# EAGLE design ms_kb_reader (EAGLE 7.2.0)
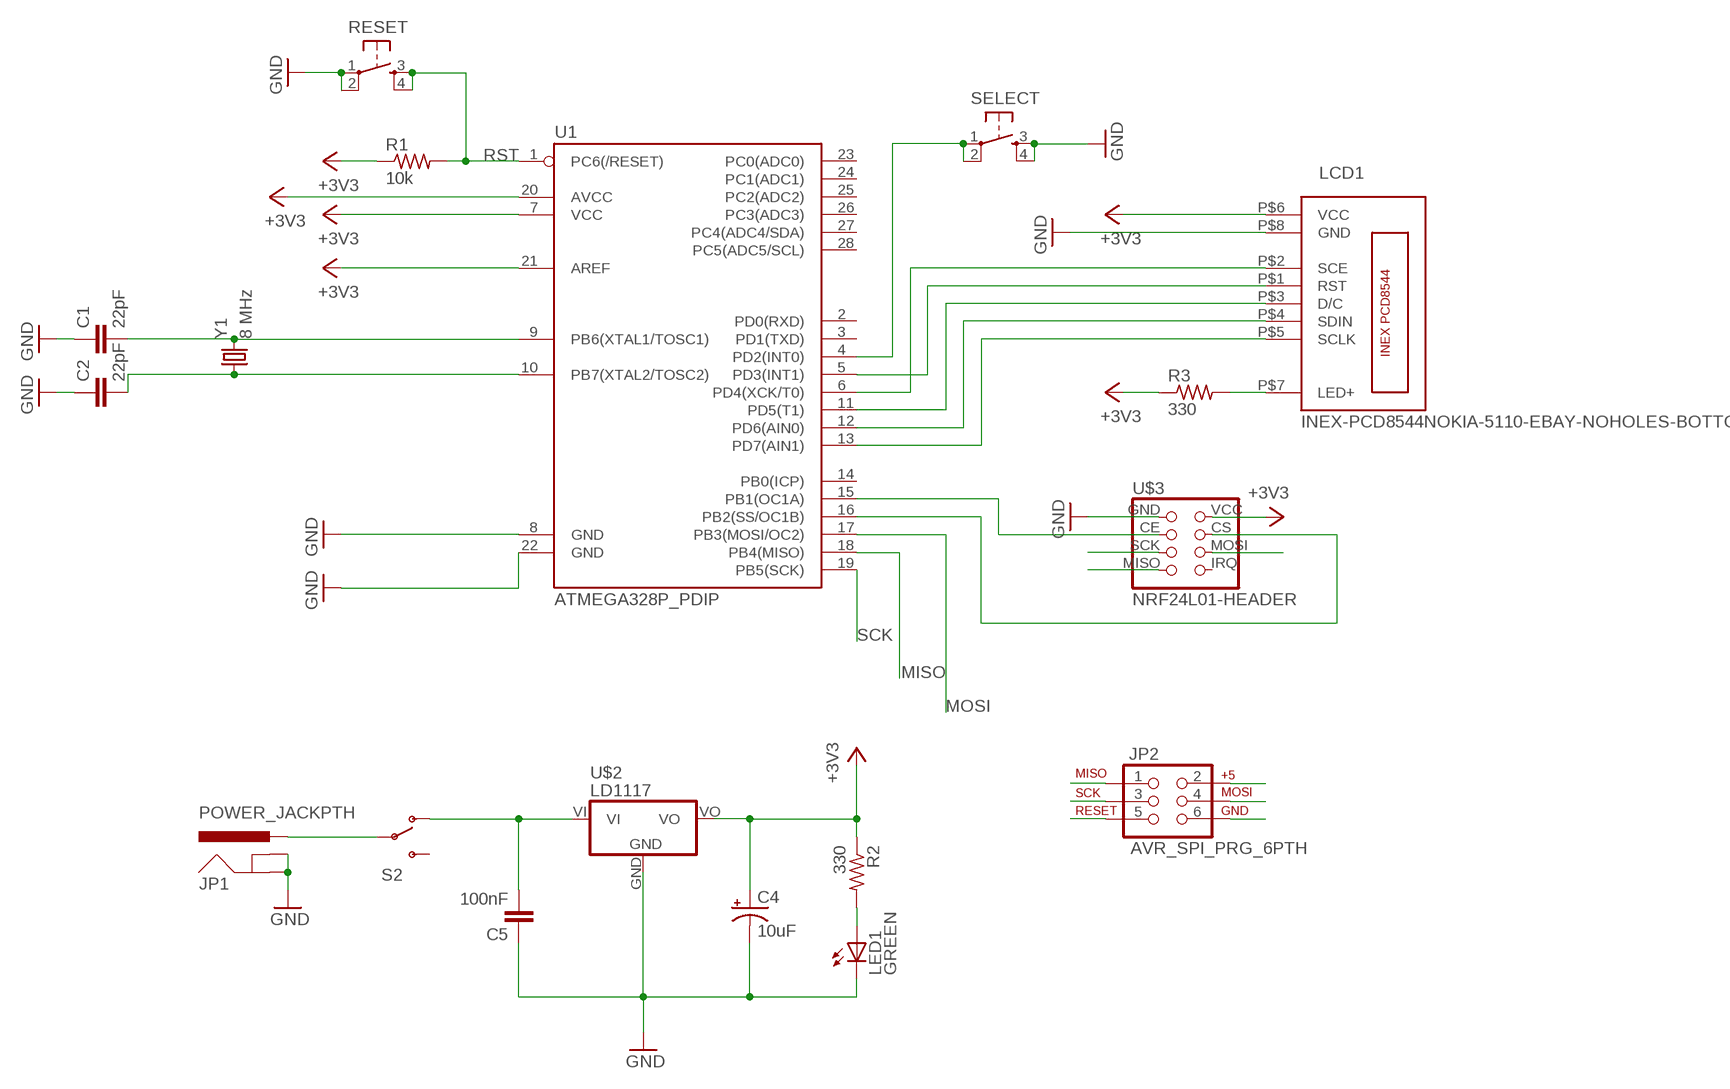
[diagram p0: schematic, sheet 1]

## Parts
C1  22pF  CAPPTH  [CAP-PTH-SMALL]
C2  22pF  CAPPTH  [CAP-PTH-SMALL]
C4  10uF  CPOL-USE2.5-5  [E2,5-5]
C5  100nF  CAPPTH  [CAP-PTH-SMALL]
JP1  POWER_JACKPTH  [POWER_JACK_PTH]
JP2  AVR_SPI_PRG_6PTH  [2X3]
LCD1  INEX-PCD8544NOKIA-5110-EBAY-NOHOLES-BOTTOM  [NOKIA-5110-EBAY-NOHOLES]
LED1  GREEN  LED5MM  [LED5MM]
R1  10k  R-US_0207/10  [0207/10]
R2  330  R-US_0207/10  [0207/10]
R3  330  R-US_0207/10  [0207/10]
RESET  TACTILE-SWITCH-PTH  [TAC-SWITCH-PTH]
S2  SWITCH-SPDTPTH_LOCK  [SWITCH-SPDT_LOCK.007S]
SELECT  TACTILE-SWITCH-PTH  [TAC-SWITCH-PTH]
U1  ATMEGA328P_PDIP  [DIL28-3]
U$2  LD1117  [LD1117]
U$3  NRF24L01-HEADER  [NRF24L01-HEADER]
Y1  8 MHz  CRYSTALHC49US  [HC49US]

## Nets
+3V3: C4.+ JP2.2 LCD1.P$6(VCC) R1.1 R2.1 R3.1 U1.7(VCC) U1.20(AVCC) U1.21(AREF) U$2.VO U$3.VCC
GND: C1.1 C2.1 C4.- C5.1 JP1.GND JP1.GNDBREAK JP2.6 LCD1.P$8(GND) LED1.K(C) RESET.1 RESET.2 SELECT.3 SELECT.4 U1.8(GND) U1.22(GND) U$2.GND U$3.GND
MISO: JP2.1 U1.18(PB4(MISO)) U$3.MISO
MOSI: JP2.4 U1.17(PB3(MOSI/OC2)) U$3.MOSI
N$1: LCD1.P$1(RST) U1.5(PD3(INT1))
N$2: LCD1.P$2(SCE) U1.6(PD4(XCK/T0))
N$3: LCD1.P$3(D/C) U1.11(PD5(T1))
N$4: LED1.A R2.2
N$5: C5.2 S2.1(O) U$2.VI
N$6: JP1.PWR S2.2(P)
N$7: LCD1.P$4(SDIN) U1.12(PD6(AIN0))
N$8: SELECT.1 SELECT.2 U1.4(PD2(INT0))
N$9: LCD1.P$5(SCLK) U1.13(PD7(AIN1))
N$10: U1.16(PB2(SS/OC1B)) U$3.CS
N$11: C2.2 U1.10(PB7(XTAL2/TOSC2)) Y1.1
N$12: C1.2 U1.9(PB6(XTAL1/TOSC1)) Y1.2
N$13: U1.15(PB1(OC1A)) U$3.CE
N$15: LCD1.P$7(LED+) R3.2
RST: JP2.5 R1.2 RESET.3 RESET.4 U1.1(PC6(/RESET))
SCK: JP2.3 U1.19(PB5(SCK)) U$3.SCK
Unconnected: S2.3(S) U1.2(PD0(RXD)) U1.3(PD1(TXD)) U1.14(PB0(ICP)) U1.23(PC0(ADC0)) U1.24(PC1(ADC1)) U1.25(PC2(ADC2)) U1.26(PC3(ADC3)) U1.27(PC4(ADC4/SDA)) U1.28(PC5(ADC5/SCL)) U$3.IRQ

## Library data of the parts
C1 C2 C5 = SparkFun-Capacitors:CAP: Capacitor Standard 0603 ceramic capacitor, and 0.1" leaded capacitor.
C4 = rcl:CPOL-US: POLARIZED CAPACITOR, American symbol
JP1 = SparkFun-Connectors:POWER_JACK: Power Jack This is the standard 5.5mm barrel jack for power. The PTH is the most common, proven, reliable, footprint. The Slot footprint only works if the mill layer is transmitted to the PCB fab house so be warned. Mating wall wart : TOL-00298 (and others); PROD_ID: CONN-08197
JP2 = SparkFun-Connectors:AVR_SPI_PRG_6: AVR ISP 6 Pin This is the reduced ISP connector for AVR programming. Common on Arduino. This footprint will take up less PCB space and can be used with a 10-pin to 6-pin adapter such as SKU: BOB-08508 **Special note about "TEST_POINT" package. The stop mask is on the top side, so if you want your programming test points to be on the bottom of your board, make sure to place this package on the bottom side of the board. This also ensure that the orientation to program from the bottom side will be correct.
LCD1 = synfinatic:INEX-PCD8544: INEX PCD8544 LCD Basically a Nokia 5110 LCD with 8 pins. Available at Robotshop.com Note that this PCB has two sets of contacts, top has pins, the bottom has through-hole pads. If you want to use the pads on the bottom, use the alternate package
LED1 = led:LED: LED OSRAM: - CHIPLED LG R971, LG N971, LY N971, LG Q971, LY Q971, LO R971, LY R971 LH N974, LH R974 LS Q976, LO Q976, LY Q976 LO Q996 - Hyper CHIPLED LW Q18S LB Q993, LB Q99A, LB R99A - SideLED LS A670, LO A670, LY A670, LG A670, LP A670 LB A673, LV A673, LT A673, LW A673 LH A674 LY A675 LS A676, LA A676, LO A676, LY A676, LW A676 LS A679, LY A679, LG A679 - Hyper Micro SIDELED® LS Y876, LA Y876, LO Y876, LY Y876 LT Y87S - SmartLED LW L88C, LW L88S LB L89C, LB L89S, LG L890 LS L89K, LO L89K, LY L89K LS L896, LA L896, LO L896, LY L896 - TOPLED LS T670, LO T670, LY T670, LG T670, LP T670 LSG T670, LSP T670, LSY T670, LOP T670, LYG T670 LG T671, LOG T671, LSG T671 LB T673, LV T673, LT T673, LW T673 LH T674 LS T676, LA T676, LO T676, LY T676, LB T676, LH T676, LSB T676, LW T676 LB T67C, LV T67C, LT T67C, LS T67K, LO T67K, LY T67K, LW E67C LS E67B, LA E67B, LO E67B, LY E67B, LB E67C, LV E67C, LT E67C LW T67C LS T679, LY T679, LG T679 LS T770, LO T770, LY T770, LG T770, LP T770 LB T773, LV T773, LT T773, LW T773 LH T774 LS E675, LA E675, LY E675, LS T675 LS T776, LA T776, LO T776, LY T776, LB T776 LHGB T686 LT T68C, LB T68C - Hyper Mini TOPLED® LB M676 - Mini TOPLED Santana® LG M470 LS M47K, LO M47K, LY M47K Source: http://www.osram.convergy.de LUXEON: - LUMILED® LXK2-PW12-R00, LXK2-PW12-S00, LXK2-PW14-U00, LXK2-PW14-V00 LXK2-PM12-R00, LXK2-PM12-S00, LXK2-PM14-U00 LXK2-PE12-Q00, LXK2-PE12-R00, LXK2-PE12-S00, LXK2-PE14-T00, LXK2-PE14-U00 LXK2-PB12-K00, LXK2-PB12-L00, LXK2-PB12-M00, LXK2-PB14-N00, LXK2-PB14-P00, LXK2-PB14-Q00 LXK2-PR12-L00, LXK2-PR12-M00, LXK2-PR14-Q00, LXK2-PR14-R00 LXK2-PD12-Q00, LXK2-PD12-R00, LXK2-PD12-S00 LXK2-PH12-R00, LXK2-PH12-S00 LXK2-PL12-P00, LXK2-PL12-Q00, LXK2-PL12-R00 Source: www.luxeon.com KINGBRIGHT: KA-3528ASYC Source: www.kingbright.com
R1-R3 = rcl:R-US_: RESISTOR, American symbol
RESET SELECT = GeekAmmo:TACTILE-SWITCH: Tactile Switch 4 Pins, SPST NO
S2 = SparkFun-Electromechanical:SWITCH-SPDT: SPDT Switch Simple slide switch, Spark Fun Electronics SKU : COM-00102 DPDT SMT slide switch, AYZ0202, SWCH-08179
U1 = SparkFun-DigitalIC:ATMEGA328P_PDIP: uC used in the Arduino 32kb flash, 1k EEPROM, 2k SRAM This is the through-hole version of this chip.
U$2 = LD1117:LD1117
U$3 = nRF24L01-header:NRF24L01-HEADER
Y1 = SparkFun-FreqCtrl:CRYSTAL: Various standard crystals. Proven footprints.

## Board
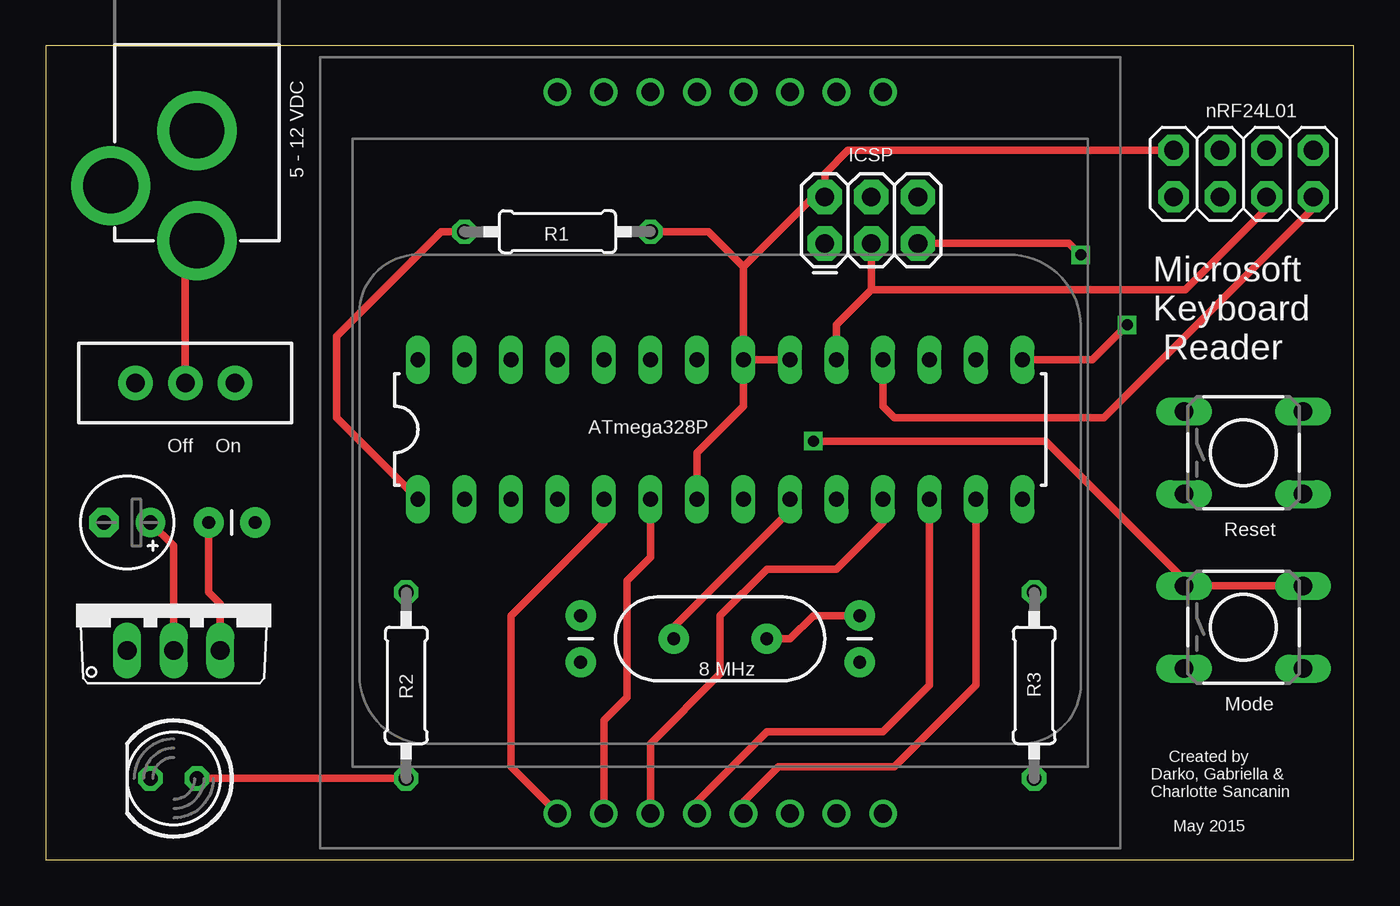
[diagram p1: board, top side]
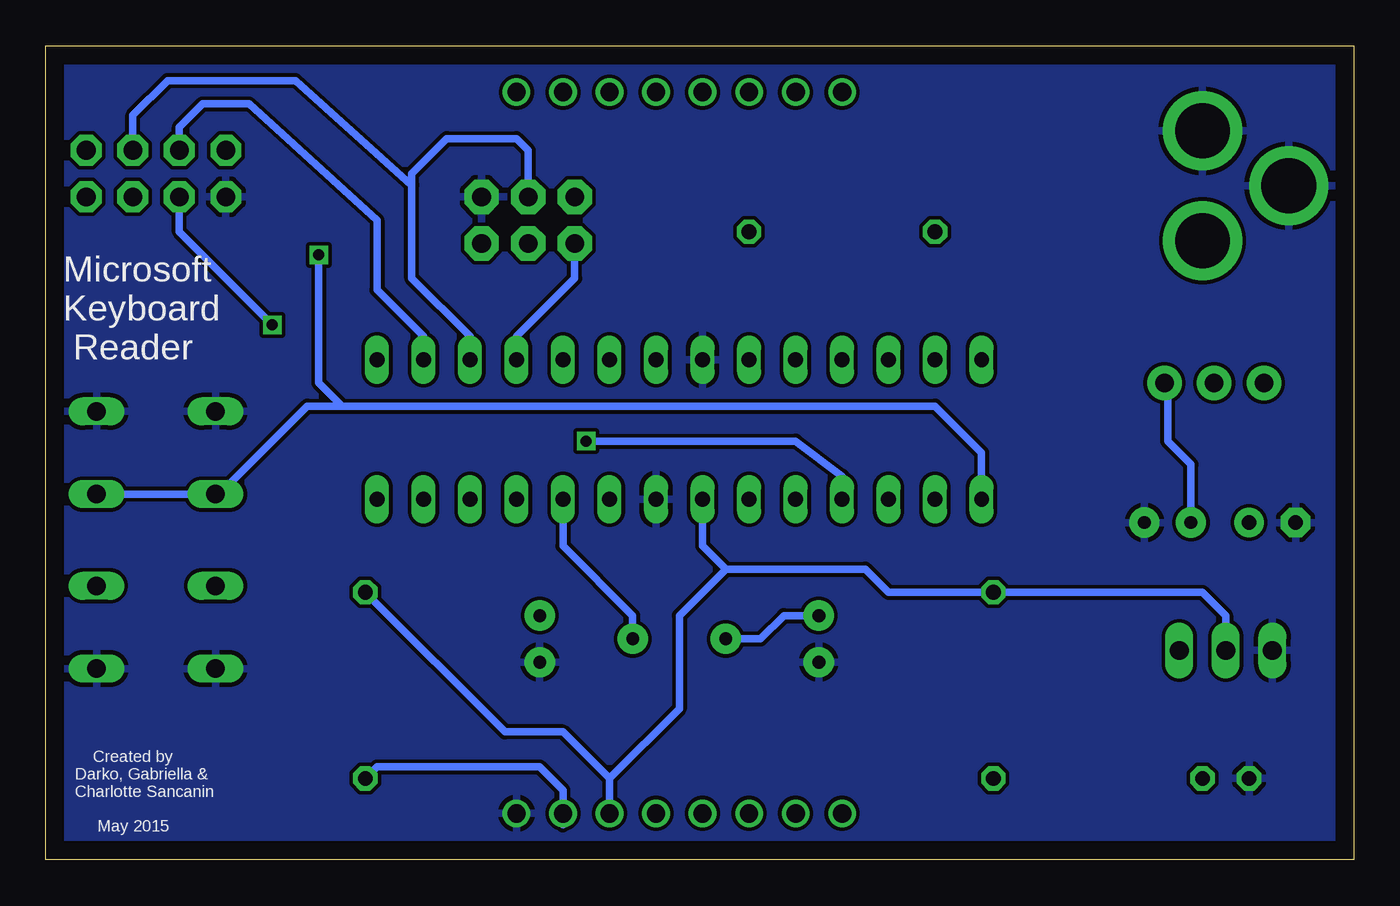
[diagram p2: board, bottom side, seen from below]

Size 71.42 x 44.44 mm. Coordinates in mm from the lower left corner, seen from the top.
Outline: 0,0 71.42,0 71.42,44.44 0,44.44 0,0
Copper layers (1*16): Top 0.035mm / dielectric 1.5mm / Bottom 0.035mm
Design rules "default": minimum track width 10mil, minimum drill 24mil, track to track 8mil, track to pad 8mil, pad to pad 8mil, via to via 8mil, smd to smd 8mil, copper to edge 40mil, drill to drill 8mil, minimum pad ring 10mil, minimum via ring 8mil, stop-mask expansion 4mil, vias tented up to drill 0mil, thermal gap 10mil

### Footprints (pad centres in the part's own frame; a part is rotated, then mirrored left to right if it is on the bottom)
CAP-PTH-SMALL = drill 0.7 pad 1.651: 1 0,0; 2 2.54,0
E2,5-5 = drill 0.813 pad 1.6: + -1.27,0 | drill 0.813 pad 1.6 octagon: - 1.27,0
POWER_JACK_PTH = drill 2.997 pad 4.318: GND 0,7.7; GNDBREAK 4.7,10.7; PWR 0,13.7
2X3 = drill 1.016 pad 1.88 octagon: 1 0,0; 2 0,2.54; 3 2.54,0; 4 2.54,2.54; 5 5.08,0; 6 5.08,2.54
NOKIA-5110-EBAY-NOHOLES = drill 1: P$1 -8.89,-15.875; P$2 -6.35,-15.875; P$3 -3.81,-15.875; P$4 -1.27,-15.875; P$5 1.27,-15.875; P$6 3.81,-15.875; P$7 6.35,-15.875; P$8 8.89,-15.875; P$9 -8.89,23.495; P$10 -6.35,23.495; P$11 -3.81,23.495; P$12 -1.27,23.495; P$13 1.27,23.495; P$14 3.81,23.495; P$15 6.35,23.495; P$16 8.89,23.495
LED5MM = drill 0.813 octagon: A -1.27,0; K 1.27,0
0207/10 = drill 0.813 octagon: 1 -5.08,0; 2 5.08,0
TAC-SWITCH-PTH = drill 1.016 pad 1.524 long: 1 -3.251,2.261; 2 3.251,2.261; 3 -3.251,-2.261; 4 3.251,-2.261
SWITCH-SPDT_LOCK.007S = drill 1.016 pad 1.88: 1 0,2.718; 2 0,0; 3 0,-2.718
DIL28-3 = drill 0.813 long: 1 -16.51,-3.81; 2 -13.97,-3.81; 3 -11.43,-3.81; 4 -8.89,-3.81; 5 -6.35,-3.81; 6 -3.81,-3.81; 7 -1.27,-3.81; 8 1.27,-3.81; 9 3.81,-3.81; 10 6.35,-3.81; 11 8.89,-3.81; 12 11.43,-3.81; 13 13.97,-3.81; 14 16.51,-3.81; 15 16.51,3.81; 16 13.97,3.81; 17 11.43,3.81; 18 8.89,3.81; 19 6.35,3.81; 20 3.81,3.81; 21 1.27,3.81; 22 -1.27,3.81; 23 -3.81,3.81; 24 -6.35,3.81; 25 -8.89,3.81; 26 -11.43,3.81; 27 -13.97,3.81; 28 -16.51,3.81
LD1117 = drill 1.016 long: GND -2.54,0; VI 2.54,0; VO 0,0
NRF24L01-HEADER = drill 1.016 pad 1.676 octagon: CE -1.27,-1.27; CS -1.27,1.27; GND -3.81,-1.27; IRQ 3.81,1.27; MISO 3.81,-1.27; MOSI 1.27,1.27; SCK 1.27,-1.27; VCC -3.81,1.27
HC49US = drill 0.7 pad 1.651: 1 -2.54,0; 2 2.54,0

### Placement (x,y rotation side)
C1  29.21,10.8 90 top
C2  44.45,10.8 90 top
C4  4.45,18.41 180 top
C5  11.43,18.41 180 top
JP1  8.26,47.5 180 top
JP2  42.55,33.66 0 top
LCD1  36.83,18.41 0 top
LED1  6.99,4.45 180 top
R1  27.94,34.29 180 top
R2  19.68,9.53 270 top
R3  53.98,9.53 270 top
RESET  65.41,22.23 0 top
S2  7.62,26.04 270 top
SELECT  65.41,12.7 0 top
U1  36.83,23.5 0 top
U$2  6.99,11.43 0 top
U$3  65.41,37.47 0 top
Y1  36.83,12.07 180 top

### Tracks (layer width: path | path; a pad name or v marks a point on that pad's centre or on a via)
+3V3
  Top 0.406: U$2.VO 6.99,17.14 C4.+ | U1.21 38.1,24.77 35.56,22.23 U1.7 | U1.20 U1.21 | 38.1,32.39 41.91,36.19 JP2.2 42.55,37.47 43.81,38.73 U$3.VCC | U1.21 38.1,32.39 | R1.1 36.2,34.29 38.1,32.39
  Bottom 0.406: U$2.VO 6.99,13.34 8.26,14.61 R2.1 25.4,14.61 26.67,15.88 34.29,15.88 | 34.29,15.88 36.83,13.34 36.83,8.26 40.64,4.45 | U1.7 35.56,17.14 34.29,15.88 | 40.64,4.45 LCD1.P$6 | 40.64,4.45 43.18,6.98 46.35,6.98 R3.1
GND
  pour Bottom: 0,45.08 0,-1.9 72.39,-1.9 72.39,45.08
MISO
  Top 0.406: U1.18 45.72,24.77 46.35,24.13 57.78,24.13 69.22,35.56 U$3.MISO
  Bottom 0.406: U1.18 45.72,28.57 42.55,31.75 JP2.1
MOSI
  Bottom 0.406: U1.17 48.26,28.57 51.44,31.75 51.44,36.83 | 51.44,36.83 57.78,42.55 64.77,42.55 66.67,40.64 U$3.MOSI | 51.44,36.83 51.44,37.47 49.53,39.37 45.72,39.37 45.09,38.73 JP2.4
N$1
  Top 0.406: U1.5 30.48,18.41 25.4,13.34 25.4,5.08 LCD1.P$1
N$2
  Top 0.406: LCD1.P$2 30.48,7.62 31.75,8.89 31.75,15.24 33.02,16.51 U1.6
N$3
  Top 0.406: LCD1.P$3 33.02,6.35 36.83,10.16 36.83,13.34 39.37,15.88 43.18,15.88 45.72,18.41 U1.11
N$4
  Top 0.406: LED1.A R2.2
N$5
  Top 0.406: C5.2 8.89,14.61 9.53,13.97 U$2.VI
  Bottom 0.406: C5.2 8.89,21.59 10.16,22.86 10.16,25.86 S2.1
N$6
  Top 0.406: S2.2 7.62,33.16 JP1.PWR
N$7
  Top 0.406: LCD1.P$4 35.56,3.18 39.37,6.98 45.72,6.98 48.26,9.53 U1.12
N$8  (via drill 0.6)
  Top 0.406: v41.91,22.86 54.61,22.86 62.15,15.32 SELECT.1 SELECT.2
  Bottom 0.406: v41.91,22.86 30.48,22.86 27.94,20.96 U1.4
N$9
  Top 0.406: LCD1.P$5 38.1,3.18 40.01,5.08 46.35,5.08 50.8,9.53 U1.13
N$10
  Bottom 0.406: U1.16 50.8,28.57 53.34,31.11 53.34,34.92 60.33,41.28 62.87,41.28 64.14,40 U$3.CS
N$11
  Top 0.406: Y1.1 40.64,12.07 41.91,13.34 C2.2
  Bottom 0.406: U1.10 43.18,17.14 39.37,13.34 Y1.1
N$12
  Top 0.406: Y1.2 34.29,12.7 40.64,19.05 U1.9
  Bottom 0.406: Y1.2 32.38,12.07 31.11,13.34 C1.2
N$13  (via drill 0.6)
  Top 0.406: v59.05,29.21 57.15,27.31 U1.15
  Bottom 0.406: U$3.CE 64.14,34.29 v59.05,29.21
N$15
  Bottom 0.406: 43.18,1.91 LCD1.P$7 43.18,3.81 44.13,4.76 44.45,5.08 53.34,5.08 R3.2
RST  (via drill 0.6)
  Top 0.406: R1.2 21.59,34.29 15.88,28.57 15.88,24.13 U1.1 | JP2.5 55.88,33.66 v56.52,33.02
  Bottom 0.406: 55.24,24.77 57.15,24.77 61.32,20.6 RESET.3 RESET.4 | 55.24,24.77 22.86,24.77 20.32,22.23 U1.1 | v56.52,33.02 56.52,26.04 55.24,24.77
SCK
  Top 0.406: 45.09,31.11 62.23,31.11 66.67,35.56 U$3.SCK | U1.19 43.18,29.21 45.09,31.11 | 45.09,31.11 JP2.3

### Text on the board
tPlace: 5 - 12 VDC | nRF24L01 | ICSP | R1 | Microsoft / Keyboard / Reader | ATmega328P | Off On | Reset | 8 MHz | R2 | R3 | Mode | Created by / Darko, Gabriella & / Charlotte Sancanin / / May 2015
bPlace: Microsoft / Keyboard / Reader | Created by / Darko, Gabriella & / Charlotte Sancanin / / May 2015